# EAGLE design Controller (EAGLE 5.10)
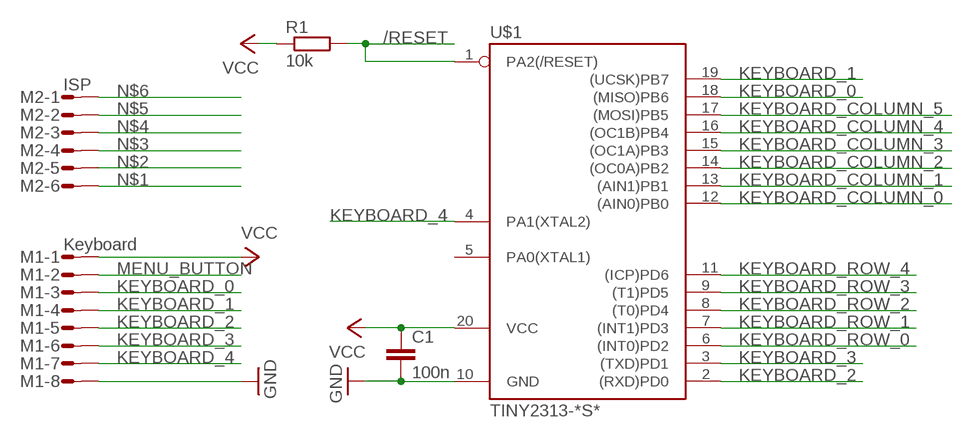
[diagram p0: schematic, sheet 1]

## Parts
C1  100n  C-EUC0603  [C0603]
M1  Keyboard  MICROMATCH-8  [MICROMATCH-8]
M2  ISP  MICROMATCH-6  [MICROMATCH-6]
R1  10k  R-EU_R0603  [R0603]
U$1  TINY2313-*S*  [SO20L$]

## Nets
/RESET: R1.2 U$1.1(PA2(/RESET))
GND: C1.2 M1.8 U$1.10(GND)
KEYBOARD_0: M1.3 U$1.18((MISO)PB6)
KEYBOARD_1: M1.4 U$1.19((UCSK)PB7)
KEYBOARD_2: M1.5 U$1.2((RXD)PD0)
KEYBOARD_3: M1.6 U$1.3((TXD)PD1)
KEYBOARD_4: M1.7 U$1.4(PA1(XTAL2))
KEYBOARD_COLUMN_0: U$1.12((AIN0)PB0)
KEYBOARD_COLUMN_1: U$1.13((AIN1)PB1)
KEYBOARD_COLUMN_2: U$1.14((OC0A)PB2)
KEYBOARD_COLUMN_3: U$1.15((OC1A)PB3)
KEYBOARD_COLUMN_4: U$1.16((OC1B)PB4)
KEYBOARD_COLUMN_5: U$1.17((MOSI)PB5)
KEYBOARD_ROW_0: U$1.6((INT0)PD2)
KEYBOARD_ROW_1: U$1.7((INT1)PD3)
KEYBOARD_ROW_2: U$1.8((T0)PD4)
KEYBOARD_ROW_3: U$1.9((T1)PD5)
KEYBOARD_ROW_4: U$1.11((ICP)PD6)
MENU_BUTTON: M1.2
N$1: M2.6
N$2: M2.5
N$3: M2.4
N$4: M2.3
N$5: M2.2
N$6: M2.1
VCC: C1.1 M1.1 R1.1 U$1.20(VCC)
Unconnected: U$1.5(PA0(XTAL1))

## Library data of the parts
C1 = resistor:C-EU: CAPACITOR, European symbol
M1 = con-amp-micromatch:MICROMATCH-8: MicroMaTch 8 7-215464-8 / 0-215464-8 Drawing Number C-215464 DDEController.pdf
M2 = con-amp-micromatch:MICROMATCH-6: MicroMaTch 6 7-215464-6 / 0-215464-6 Drawing Number C-215464 DDEController.pdf
R1 = resistor:R-EU_: RESISTOR, European symbol
U$1 = avr-6:TINY2313*: Atmel Tiny2313 2K Flash, 128 bytes EEPROM, 128 bytes RAM

## Board
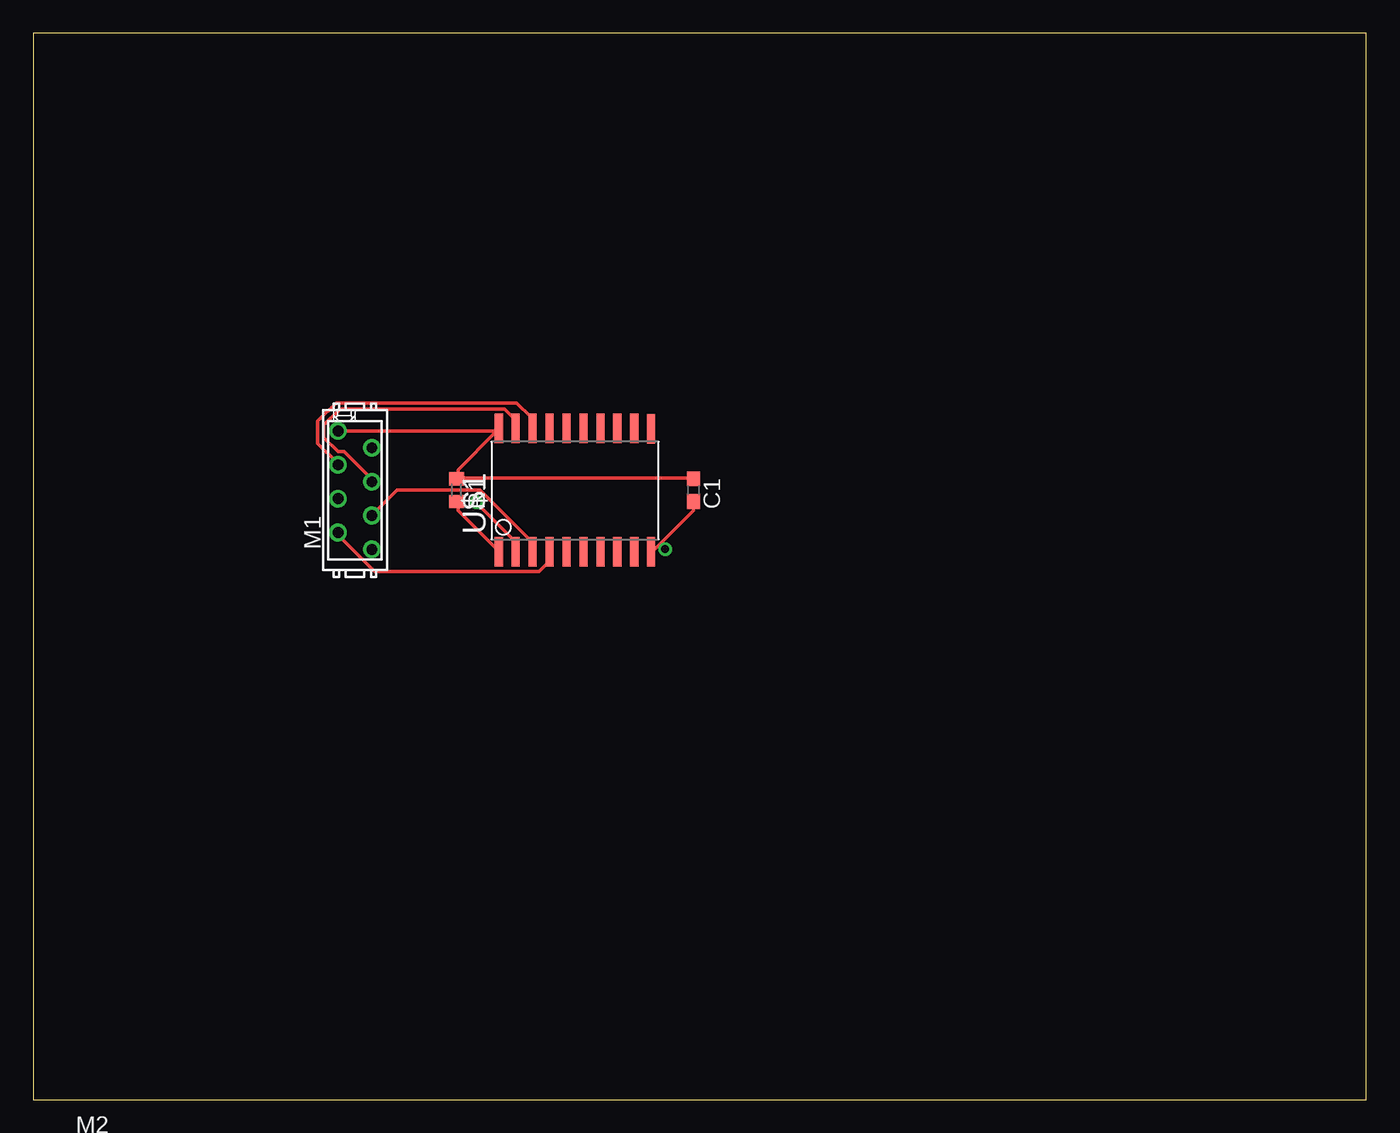
[diagram p1: board, top side]
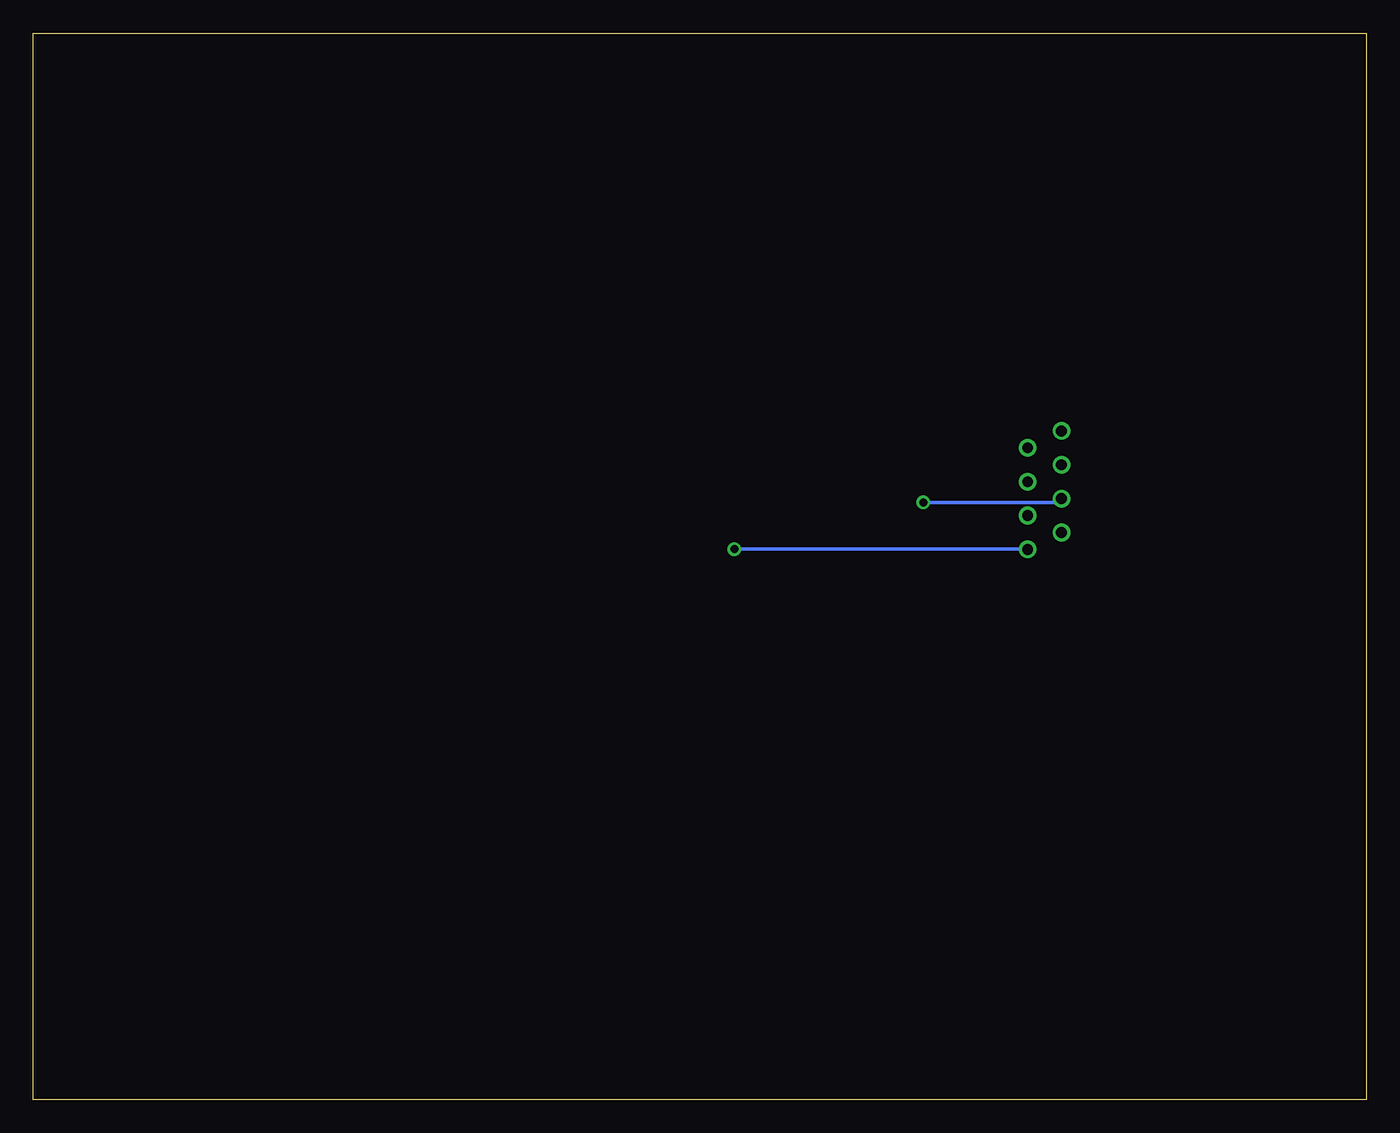
[diagram p2: board, bottom side, seen from below]

Size 100 x 80 mm. Coordinates in mm from the lower left corner, seen from the top.
Outline: 0,0 100,0 100,80 0,80 0,0
Copper layers (1*16): Top 0.035mm / dielectric 1.5mm / Bottom 0.035mm
Design rules "default": minimum track width 10mil, minimum drill 24mil, track to track 8mil, track to pad 8mil, pad to pad 8mil, via to via 8mil, smd to smd 8mil, copper to edge 40mil, drill to drill 8mil, minimum pad ring 10mil, minimum via ring 8mil, stop-mask expansion 4mil, vias tented up to drill 0mil, thermal gap 10mil

### Footprints (pad centres in the part's own frame; a part is rotated, then mirrored left to right if it is on the bottom)
C0603 = smd 1.1 x 1: 1 -0.85,0; 2 0.85,0
MICROMATCH-8 = drill 0.813 round: 1 4.445,1.27; 2 3.175,-1.27; 3 1.905,1.27; 4 0.635,-1.27; 5 -0.635,1.27; 6 -1.905,-1.27; 7 -3.175,1.27; 8 -4.445,-1.27
MICROMATCH-6 = drill 0.813 round: 1 3.175,1.27; 2 1.905,-1.27; 3 0.635,1.27; 4 -0.635,-1.27; 5 -1.905,1.27; 6 -3.175,-1.27
R0603 = smd 1 x 1.1: 1 -0.85,0; 2 0.85,0
SO20L$ = smd 0.61 x 2.21: 1 -5.715,-4.636; 2 -4.445,-4.636; 3 -3.175,-4.636; 4 -1.905,-4.636; 5 -0.635,-4.636; 6 0.635,-4.636; 7 1.905,-4.636; 8 3.175,-4.636; 9 4.445,-4.636; 10 5.715,-4.636; 11 5.715,4.61; 12 4.445,4.636; 13 3.175,4.636; 14 1.905,4.636; 15 0.635,4.636; 16 -0.635,4.636; 17 -1.905,4.636; 18 -3.175,4.636; 19 -4.445,4.636; 20 -5.715,4.636

### Placement (x,y rotation side)
C1  49.53,45.72 270 top
M1  24.13,45.72 90 top
M2  6.35,-5.08 0 top  (outside the outline)
R1  31.75,45.72 270 top
U$1  40.64,45.72 0 top

### Tracks (layer width: path | path; a pad name or v marks a point on that pad's centre or on a via)
/RESET
  Top 0.254: R1.2 31.85,44.81 31.85,44.2 34.9,41.15 U$1.1
GND  (via drill 0.61)
  Top 0.254: 47.02,41.68 46.48,41.15 U$1.10 | 47.02,41.68 49.53,44.2 C1.2 | v47.4,41.3 47.02,41.68
  Bottom 0.254: v47.4,41.3 25.45,41.3 M1.8
KEYBOARD_0
  Top 0.254: U$1.18 37.34,50.44 37.34,51.21 36.27,52.27 22.71,52.27 21.34,50.9 21.34,49.23 22.86,47.7 M1.3
KEYBOARD_1
  Top 0.254: U$1.19 36.12,50.44 36.12,51.05 35.36,51.82 23.01,51.82 21.79,50.6 21.79,49.68 22.86,48.62 23.32,48.62 25.45,46.48 M1.4
KEYBOARD_2  (via drill 0.61)
  Top 0.254: v33.22,44.81 36.12,41.91 36.12,41.15 U$1.2
  Bottom 0.254: v33.22,44.81 23.01,44.81 22.86,44.96 M1.5
KEYBOARD_3
  Top 0.254: U$1.3 37.34,41.15 37.34,41.91 33.53,45.72 27.28,45.72 25.45,43.89 M1.6
KEYBOARD_4
  Top 0.254: U$1.4 38.71,41 38.71,40.39 37.95,39.62 25.6,39.62 22.86,42.37 M1.7
VCC
  Top 0.254: 31.85,46.63 31.85,47.24 34.67,50.06 | 34.67,50.06 34.9,50.29 U$1.20 | 31.85,46.63 49.53,46.63 C1.1 | 31.85,46.63 R1.1 | M1.1 22.86,50.14 34.59,50.14 34.67,50.06